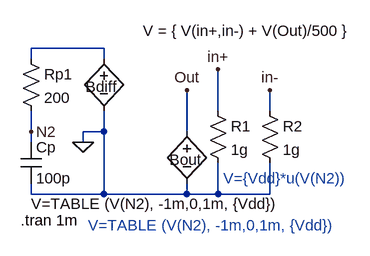
[diagram p0: schematic Compara.asc]
Compara.asc, the LTspice schematic file:
Version 4
SHEET 1 880 680
WIRE 144 96 32 96
WIRE 32 112 32 96
WIRE 144 112 144 96
WIRE 320 192 320 128
WIRE 400 192 400 160
WIRE 32 224 32 192
WIRE 144 224 144 192
WIRE 144 224 112 224
WIRE 272 224 272 160
WIRE 32 240 32 224
WIRE 112 240 112 224
WIRE 32 320 32 304
WIRE 144 320 144 224
WIRE 144 320 32 320
WIRE 272 320 272 304
WIRE 272 320 144 320
WIRE 320 320 320 272
WIRE 320 320 272 320
WIRE 400 320 400 272
WIRE 400 320 320 320
FLAG 112 240 0
FLAG 272 160 Out
FLAG 320 128 in+
FLAG 400 160 in-
FLAG 32 224 N2
SYMBOL bv 144 96 R0
WINDOW 3 60 -27 Left 0
WINDOW 0 -28 59 Left 0
SYMATTR Value V = { V(in+,in-) + V(Out)/500 }
SYMATTR InstName Bdiff
SYMBOL res 16 96 R0
SYMATTR InstName Rp1
SYMATTR Value 200
SYMBOL cap 16 240 R0
SYMATTR InstName Cp
SYMATTR Value 100p
SYMBOL bv 272 208 R0
WINDOW 3 -240 127 Left 0
WINDOW 0 -27 59 Left 0
SYMATTR Value V=TABLE (V(N2), -1m,0,1m, {Vdd})
SYMATTR InstName Bout
SYMBOL res 304 176 R0
SYMATTR InstName R1
SYMATTR Value 1g
SYMBOL res 384 176 R0
SYMATTR InstName R2
SYMATTR Value 1g
TEXT 16 360 Left 0 !.tran 1m
TEXT 120 368 Left 0 ;V=TABLE (V(N2), -1m,0,1m, {Vdd})
TEXT 328 296 Left 0 ;V={Vdd}*u(V(N2))

The netlist it stands for:
* Compara.asc
Bdiff N001 0 V = { V(in+,in-) + V(Out)/500 }
Rp1 N001 N2 200
Cp N2 0 100p
Bout Out 0 V=TABLE (V(N2), -1m,0,1m, {Vdd})
R1 in+ 0 1g
R2 in- 0 1g
.tran 1m
* V=TABLE (V(N2), -1m,0,1m, {Vdd})
* V={Vdd}*u(V(N2))
.backanno
.end